# Altium schematic sheet FanConn.SchDoc
size A4
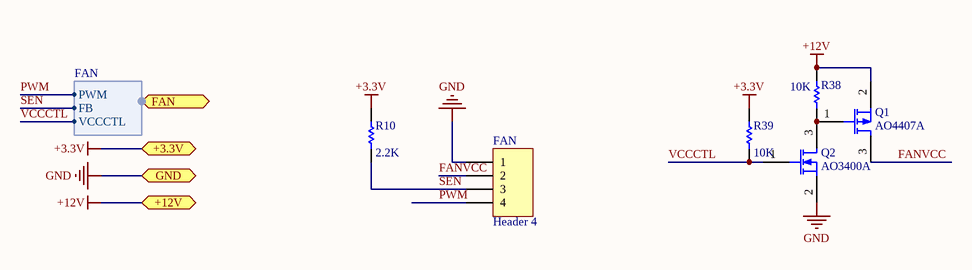
[diagram p0: FanConn.SchDoc]

## Parts
FAN  Header 4  [FAN_CONN-4P]
Q1  AO4407A  [SOP8-MOS]
Q2  AO3400A  [SOT23B]
R10  value 2.2K  [R-1608[0603]]
R38  value 10K  [R-1608[0603]]
R39  value 10K  [R-1608[0603]]

## Ports
+3.3V, +12V, FAN (harness FAN), GND

## Harnesses
FAN: PWM, FB, VCCCTL

## Nets
+3.3V: R10.2 R39.1 ; port +3.3V
+12V: Q1.2(S) R38.1 ; port +12V
GND: FAN.1 Q2.2(S) ; port GND
FANVCC: FAN.2 Q1.3(D)
PWM: FAN.4 ; port FAN.PWM
SEN: FAN.3 R10.1 ; port FAN.FB
VCCCTL: Q2.1(G) R39.2 ; port FAN.VCCCTL
NetQ1_1: Q1.1(G) Q2.3(D) R38.2

## Library data of the parts
FAN = Header 4: Header, 4-Pin; LatestRevisionDate: 17-Jul-2002; LatestRevisionNote: Re-released for DXP Platform.; Publisher: Altium Limited
Q1 = SI2301: P-Channel MOSFET; pin to pad: 1>G 2>S 3>D; Published: 8-Jun-2000; LatestRevisionDate: 17-Jul-2002; LatestRevisionNote: Re-released for DXP Platform.; PackageVersion: 1995/1996; PackageReference: E3; Publisher: Altium Limited
Q2 = SI2302: N-Channel MOSFET; Published: 8-Jun-2000; LatestRevisionDate: 17-Jul-2002; LatestRevisionNote: Re-released for DXP Platform.; PackageVersion: 1995/1996; PackageReference: E3; Publisher: Altium Limited
R10 R38 R39 = Res Semi: Semiconductor Resistor; Published: 8-Jun-2000; LatestRevisionDate: 17-Jul-2002; LatestRevisionNote: Re-released for DXP Platform.; PackageReference: AXIAL-0.5; Publisher: Altium Limited; PackageDescription: Axial Device, Thru-Hole; 2 Leads; 0.5 in Pin Spacing